# Altium schematic sheet XMC4504.SchDoc: <Project Name>
size A3; ApprovedBy: <Appr.>; Author: <Author>; CompanyName: Infineon Technologies AG; Engineer: <Rel.>; Organization: Infineon Technologies AG; Address1: IFAG DES S PS; Address2: Am Campeon 1-12  -  85579 Neubiberg  -  Germany; Address3: 85579 Neubiberg; Address4: Germany; Revision: <Rev.>; SheetNumber: 3; SheetTotal: 3; Release: RC00; PageSetup: Record=PageOptions|CenterHorizontal=True|CenterVertical=True|PrintScale=1.01|XCorrection=1.00|YCorrection=1.00|PrintKind=0|BorderSize=5000000|LeftOffset=0|BottomOffset=0|Orientation=2|PaperLength=1000|PaperWidth=1000|Scale=100|PaperSource=7|PrintQuality=-4|MediaType=1|DitherType=10|PaperKind=A3|PrintScaleMode=1; Doc_ConfidentialStatus: <Doc_ConfidentialStatus>; Doc_Preliminary: <Doc_Preliminary>
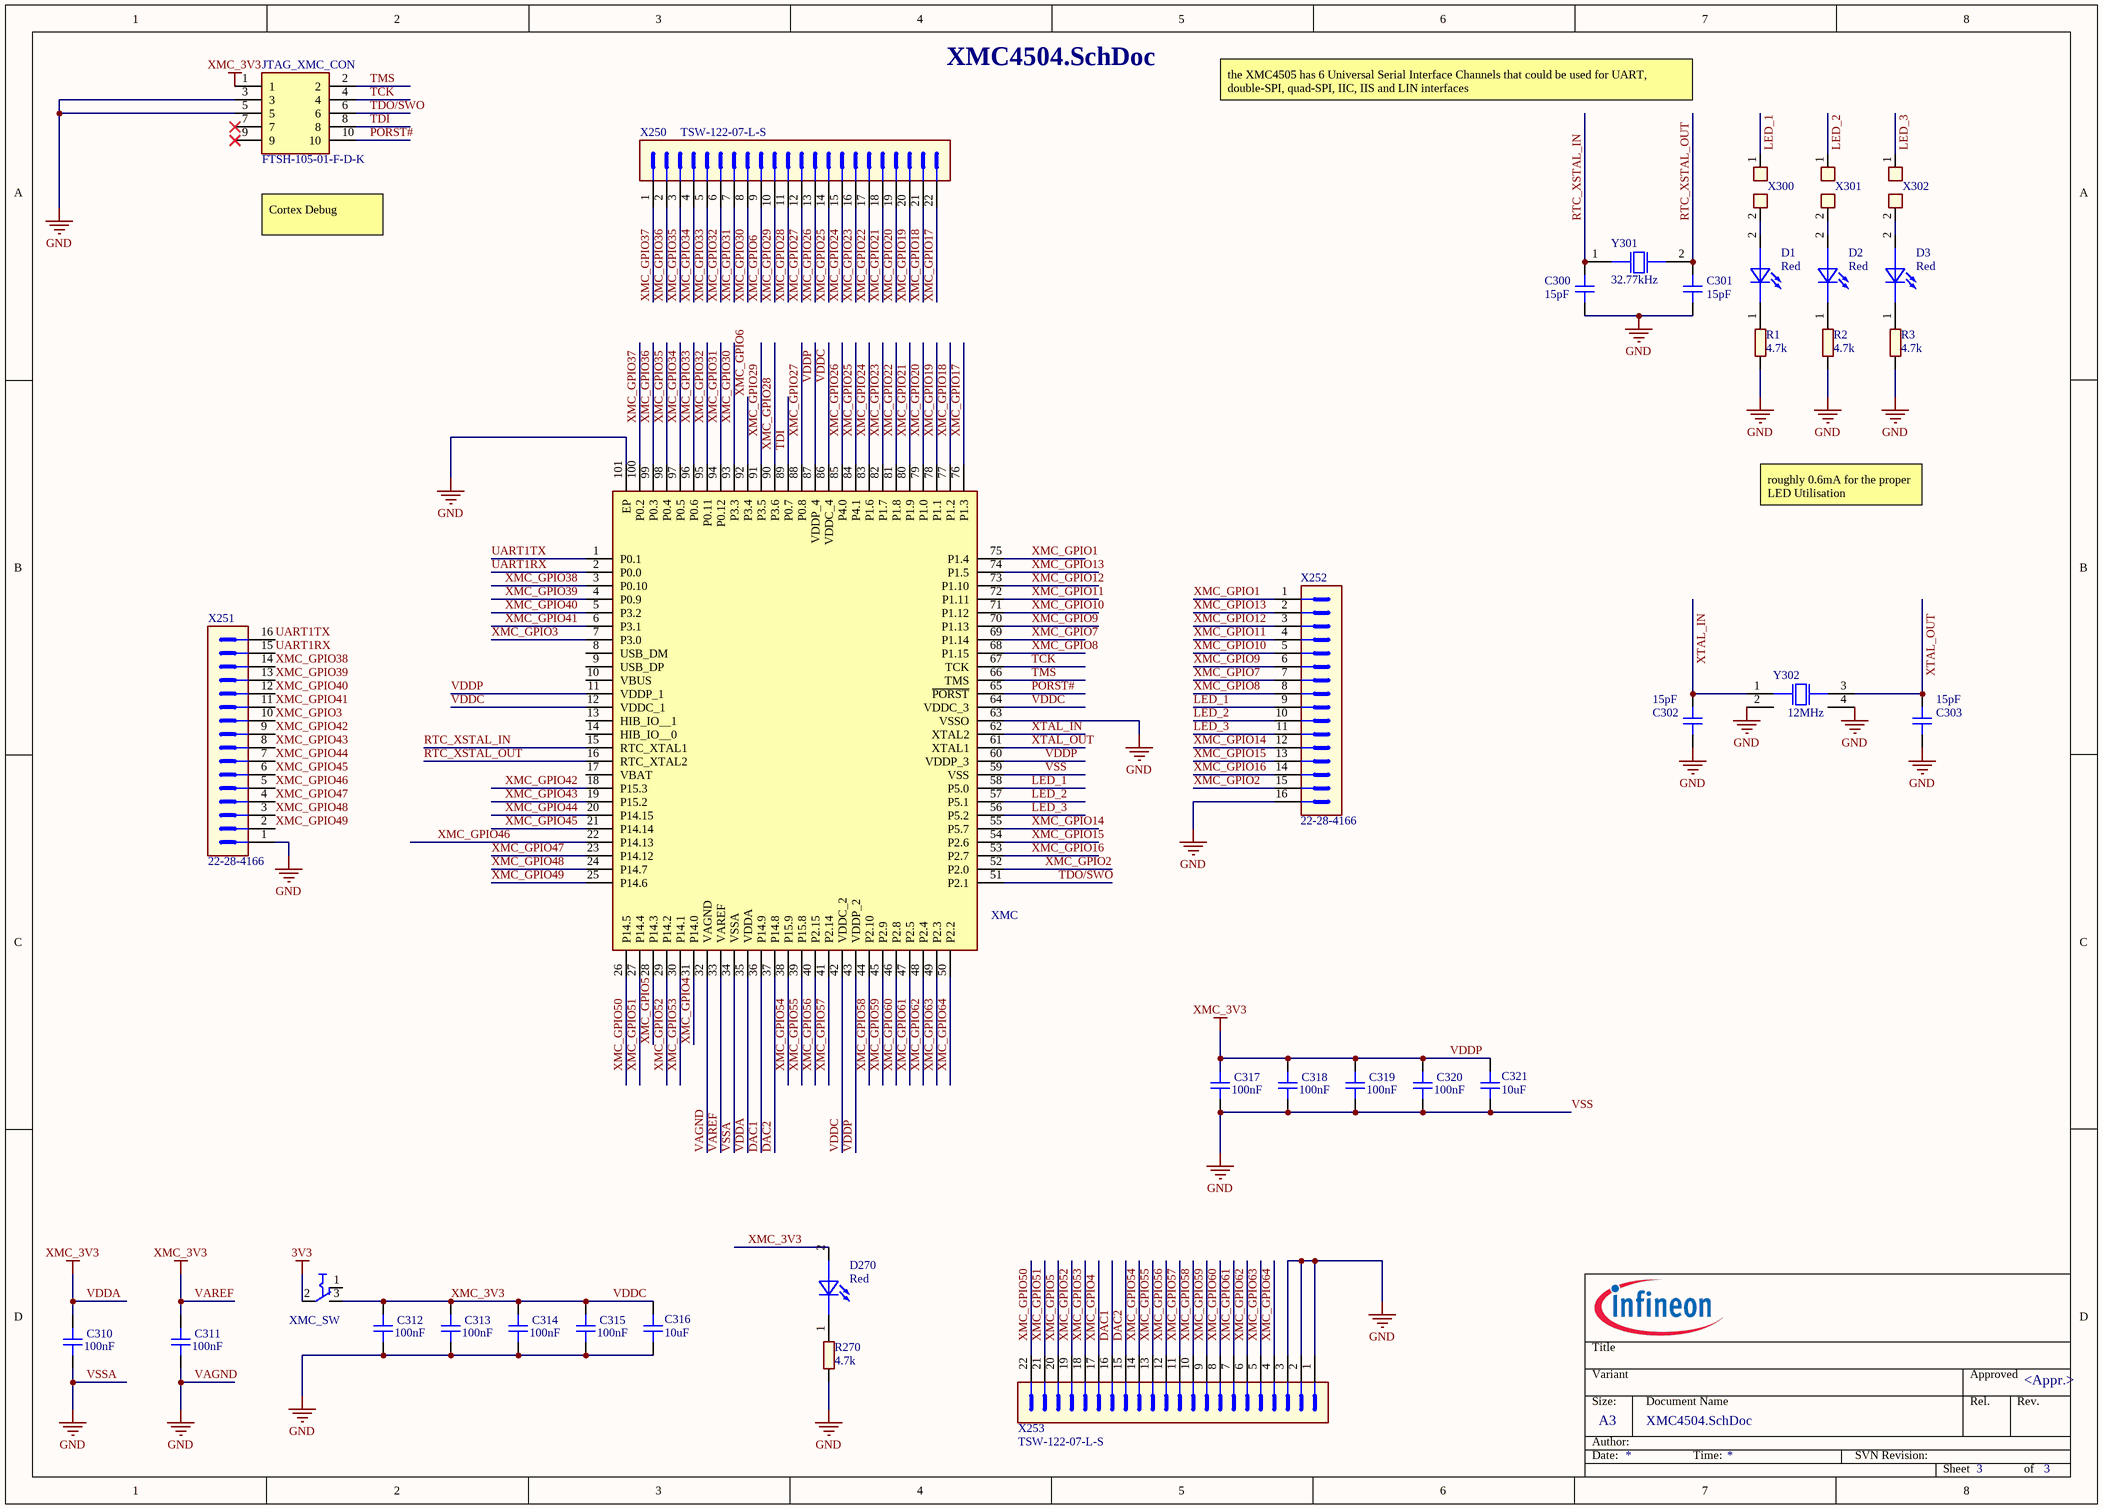
[diagram p0: XMC4504.SchDoc]

## Parts
C300  15pF  [CAPC1608X90N]
C301  15pF  [CAPC1608X90N]
C302  15pF  [CAPC1608X90N]
C303  15pF  [CAPC1608X90N]
C310  100nF  [CAPC1608X90N-2]
C311  100nF  [CAPC1608X90N-2]
C312  100nF  [CAPC1608X90N-2]
C313  100nF  [CAPC1608X90N-2]
C314  100nF  [CAPC1608X90N-2]
C315  100nF  [CAPC1608X90N-2]
C316  10uF  [CAPC3216X190N-1]
C317  100nF  [CAPC1608X90N-2]
C318  100nF  [CAPC1608X90N-2]
C319  100nF  [CAPC1608X90N-2]
C320  100nF  [CAPC1608X90N-2]
C321  10uF  [CAPC3216X190N-1]
D1  Red  [LEDSC160X80X80-2N-1]
D2  Red  [LEDSC160X80X80-2N-1]
D3  Red  [LEDSC160X80X80-2N-1]
D270  Red  [LEDSC160X80X80-2N-1]
JTAG_XMC_CON  FTSH-105-01-F-D-K  [FTSH-105-XX-YYY-D-K]
R1  4.7k  [RESC1609X55N]
R2  4.7k  [RESC1609X55N]
R3  4.7k  [RESC1609X55N]
R270  4.7k  [RESC1609X55N]
X250  TSW-122-07-L-S  [CON-M-THT-TSW-122-07-L-S]
X251  22-28-4166  [HDRV16W66P254_1X16_4064X249X838B]
X252  22-28-4166  [HDRV16W66P254_1X16_4064X249X838B]
X253  TSW-122-07-L-S  [CON-M-THT-TSW-122-07-L-S]
X300  Solder Jumper 2 Pins  [SOLDER_BRIDGE_0.7X1.299PAD]  (value not drawn)
X301  Solder Jumper 2 Pins  [SOLDER_BRIDGE_0.7X1.299PAD]  (value not drawn)
X302  Solder Jumper 2 Pins  [SOLDER_BRIDGE_0.7X1.299PAD]  (value not drawn)
XMC  XMC4504F100F512ACXQMA1  [QFP50P1600X1600X160-101N]  (value not drawn)
XMC_SW  CL-SB-12A-01T  [SW-SMD-CL-SB-12A-01T]  (value not drawn)
Y301  32.77kHz  [XTAL-SMD-NX3215SA-32.768K-STD-MUS-2]
Y302  12MHz  [XTAL-SMD-NX3225SA]

## Nets
3V3: XMC_SW.2
VAGND: C300.1 C301.1 C302.1 C303.1 C310.2 C311.2 C312.2 C313.2 C314.2 C315.2 C316.1 C317.2 C318.2 C319.2 C320.2 C321.1 JTAG_XMC_CON.3 JTAG_XMC_CON.5 R1.1 R2.1 R3.1 R270.1 X251.1 X252.16 X253.1 X253.2 X253.3 XMC.32(VAGND) XMC.34(VSSA) XMC.59(VSS) XMC.63(VSSO) XMC.101(EP) Y302.2 Y302.4  [also labelled GND, VSS, VSSA]
VAREF: C310.1 C311.1 C312.1 C313.1 C314.1 C315.1 C316.2 C317.1 C318.1 C319.1 C320.1 C321.2 D270.2(Anode) JTAG_XMC_CON.1 XMC.11(VDDP_1) XMC.12(VDDC_1) XMC.33(VAREF) XMC.35(VDDA) XMC.42(VDDC_2) XMC.43(VDDP_2) XMC.60(VDDP_3) XMC.64(VDDC_3) XMC.86(VDDC_4) XMC.87(VDDP_4) XMC_SW.3  [also labelled VDDA, VDDC, VDDP, XMC_3V3]
DAC1: X253.16 XMC.36(P14.9)
DAC2: X253.15 XMC.37(P14.8)
LED_1: X252.9 X300.1 XMC.58(P5.0)
LED_2: X252.10 X301.1 XMC.57(P5.1)
LED_3: X252.11 X302.1 XMC.56(P5.2)
PORST#: JTAG_XMC_CON.10 XMC.65(~{PORST})
RTC_XSTAL_IN: C300.2 XMC.15(RTC_XTAL1) Y301.1
RTC_XSTAL_OUT: C301.2 XMC.16(RTC_XTAL2) Y301.2
TCK: JTAG_XMC_CON.4 XMC.67(TCK)
TDI: JTAG_XMC_CON.8 XMC.89(P0.7)
TDO/SWO: JTAG_XMC_CON.6 XMC.51(P2.1)
TMS: JTAG_XMC_CON.2 XMC.66(TMS)
UART1RX: X251.15 XMC.2(P0.0)
UART1TX: X251.16 XMC.1(P0.1)
XMC_GPIO1: X252.1 XMC.75(P1.4)
XMC_GPIO2: X252.15 XMC.52(P2.0)
XMC_GPIO3: X251.10 XMC.7(P3.0)
XMC_GPIO4: X253.17 XMC.31(P14.0)
XMC_GPIO5: X253.20 XMC.28(P14.3)
XMC_GPIO6: X250.9 XMC.92(P3.4)
XMC_GPIO7: X252.7 XMC.69(P1.14)
XMC_GPIO8: X252.8 XMC.68(P1.15)
XMC_GPIO9: X252.6 XMC.70(P1.13)
XMC_GPIO10: X252.5 XMC.71(P1.12)
XMC_GPIO11: X252.4 XMC.72(P1.11)
XMC_GPIO12: X252.3 XMC.73(P1.10)
XMC_GPIO13: X252.2 XMC.74(P1.5)
XMC_GPIO14: X252.12 XMC.55(P5.7)
XMC_GPIO15: X252.13 XMC.54(P2.6)
XMC_GPIO16: X252.14 XMC.53(P2.7)
XMC_GPIO17: X250.22 XMC.76(P1.3)
XMC_GPIO18: X250.21 XMC.77(P1.2)
XMC_GPIO19: X250.20 XMC.78(P1.1)
XMC_GPIO20: X250.19 XMC.79(P1.0)
XMC_GPIO21: X250.18 XMC.80(P1.9)
XMC_GPIO22: X250.17 XMC.81(P1.8)
XMC_GPIO23: X250.16 XMC.82(P1.7)
XMC_GPIO24: X250.15 XMC.83(P1.6)
XMC_GPIO25: X250.14 XMC.84(P4.1)
XMC_GPIO26: X250.13 XMC.85(P4.0)
XMC_GPIO27: X250.12 XMC.88(P0.8)
XMC_GPIO28: X250.11 XMC.90(P3.6)
XMC_GPIO29: X250.10 XMC.91(P3.5)
XMC_GPIO30: X250.8 XMC.93(P3.3)
XMC_GPIO31: X250.7 XMC.94(P0.12)
XMC_GPIO32: X250.6 XMC.95(P0.11)
XMC_GPIO33: X250.5 XMC.96(P0.6)
XMC_GPIO34: X250.4 XMC.97(P0.5)
XMC_GPIO35: X250.3 XMC.98(P0.4)
XMC_GPIO36: X250.2 XMC.99(P0.3)
XMC_GPIO37: X250.1 XMC.100(P0.2)
XMC_GPIO38: X251.14 XMC.3(P0.10)
XMC_GPIO39: X251.13 XMC.4(P0.9)
XMC_GPIO40: X251.12 XMC.5(P3.2)
XMC_GPIO41: X251.11 XMC.6(P3.1)
XMC_GPIO42: X251.9 XMC.18(P15.3)
XMC_GPIO43: X251.8 XMC.19(P15.2)
XMC_GPIO44: X251.7 XMC.20(P14.15)
XMC_GPIO45: X251.6 XMC.21(P14.14)
XMC_GPIO46: X251.5 XMC.22(P14.13)
XMC_GPIO47: X251.4 XMC.23(P14.12)
XMC_GPIO48: X251.3 XMC.24(P14.7)
XMC_GPIO49: X251.2 XMC.25(P14.6)
XMC_GPIO50: X253.22 XMC.26(P14.5)
XMC_GPIO51: X253.21 XMC.27(P14.4)
XMC_GPIO52: X253.19 XMC.29(P14.2)
XMC_GPIO53: X253.18 XMC.30(P14.1)
XMC_GPIO54: X253.14 XMC.38(P15.9)
XMC_GPIO55: X253.13 XMC.39(P15.8)
XMC_GPIO56: X253.12 XMC.40(P2.15)
XMC_GPIO57: X253.11 XMC.41(P2.14)
XMC_GPIO58: X253.10 XMC.44(P2.10)
XMC_GPIO59: X253.9 XMC.45(P2.9)
XMC_GPIO60: X253.8 XMC.46(P2.8)
XMC_GPIO61: X253.7 XMC.47(P2.5)
XMC_GPIO62: X253.6 XMC.48(P2.4)
XMC_GPIO63: X253.5 XMC.49(P2.3)
XMC_GPIO64: X253.4 XMC.50(P2.2)
XTAL_IN: C302.2 XMC.62(XTAL2) Y302.1
XTAL_OUT: C303.2 XMC.61(XTAL1) Y302.3
NetD1_1: D1.1(Cathode) R1.2
NetD1_2: D1.2(Anode) X300.2
NetD2_1: D2.1(Cathode) R2.2
NetD2_2: D2.2(Anode) X301.2
NetD3_1: D3.1(Cathode) R3.2
NetD3_2: D3.2(Anode) X302.2
NetD270_1: D270.1(Cathode) R270.2

Not connected (* = marked no-connect by the designer): JTAG_XMC_CON 7* 9*; XMC 8(USB_DM) 9(USB_DP) 10(VBUS) 13(HIB_IO__1) 14(HIB_IO__0) 17(VBAT); XMC_SW 1

## Notes on the sheet
- the XMC4505 has 6 Universal Serial Interface Channels that could be used for UART, double-SPI, quad-SPI, IIC, IIS and LIN interfaces
- Cortex Debug
- roughly 0.6mA for the proper LED Utilisation
- Title
- Variant
- Approved
- Date:
- Author:
- Size:
- A3
- Document Name
- Time:
- SVN Revision:
- Rel.
- Rev.
- Sheet
- of

## Library data of the parts
C300-C303 = 267405: CAP / CERA / 15pF / 50V / 2% / C0G (EIA) / NP0 / -55°C to 125°C / 0603(1608) / SMD / -; Multiple Parts: No; Legacy PartNumber: CAP01002488; Manufacturer: MuRata; Manufacturer Order Number: GRM1885C1H150GA01; Symbol Type: Capacitor; Single; Standard; 2 Pins; Alternate View: Yes; Article Number: 267405; Version Number: V01; Combined Parameters: TC:C0G (EIA) / NP0;Tol.:-2%/+2%;Vdc:50V; QuickPick: 15pF / 50V / 2% / C0G (EIA) / NP0 / 0603 (1608); Type: Standard; Style: Single; Package Metric: 1608; Package Imperial: 0603; ComponentStatus: Released; PLMStatus: Not Recommended For New Designs; Legacy DeviceID: CAP01002488; Part Type: Capacitor; Value: 15pF; Tolerance Neg: 2%; Tolerance Pos: 2%; Application: Standard; Technology: Ceramic; Temperature min: -55; Temperature max: 125; Temperature Range: Military; ROHS Compliant: Y; Automotive Qualified: No; PackageReference: 0603 (1608); ComponentLink1Description: Vendor WebSite; ComponentLink1URL: http://www.murata.com/; ComponentLink2Description: Datasheet; ComponentLink2URL: http://webnetprod.muc.infineon.com/PCBPortal_Prod/WorkFlows/AltiumComponent/StandardDocumentation?Versionid=267406; Supplier 1: Farnell; Supplier 2: DigiKey; Supplier 3: Mouser; Second Source allowed: Yes; Voltage DC (max): 50V; Package Description: Capacitor,non-polarized,Chip;1.60mm L X 0.80mm W X 0.90mm H
C310-C315 C317-C320 = 479045: CAP / CERA / 100nF / 50V / 10% / X7R (EIA) / -55°C to 125°C / 0603 / SMD / -; Multiple Parts: No; Manufacturer: AVX; Manufacturer Order Number: 06035C104KAT2A; Symbol Type: Capacitor; Single; Standard; 2 Pins; Alternate View: Yes; Article Number: 479045; Version Number: V01; Combined Parameters: TC:X7R (EIA);Tol.:-10%/+10%;Vdc:50V; QuickPick: 100nF / 50V / 10% / X7R (EIA) / 0603; Type: Standard; Style: Single; ComponentStatus: Released; PLMStatus: Active; Part Type: Capacitor; Value: 100nF; Tolerance Neg: 10%; Tolerance Pos: 10%; Application: Standard; Technology: Ceramic; Temperature min: -55; Temperature max: 125; Temperature Range: Military; ROHS Compliant: Y; Automotive Qualified: No; PackageReference: 0603; ComponentLink1Description: Vendor WebSite; ComponentLink1URL: http://www.avx.com; ComponentLink2Description: Datasheet; ComponentLink2URL: http://webnetprod.muc.infineon.com/PCBPortal_Prod/WorkFlows/AltiumComponent/StandardDocumentation?Versionid=479046; Supplier 1: Farnell; Supplier Part Number 1: 2280883; Supplier 2: DigiKey; Supplier Part Number 2: 478-5052-2-ND; Supplier 3: Mouser; Supplier Part Number 3: 581-06035C104KAT2A; Second Source allowed: Yes; Voltage DC (max): 50V; Package Description: Capacitor,non-polarized,Chip;1.60mm L X 0.81mm W X 0.90mm H
C316 C321 = 648992: CAP / CERA / 10uF / 50V / 20% / X5R (EIA) / -55°C to 85°C / 1206 (3216) / SMD / -; Multiple Parts: No; Manufacturer: Taiyo Yuden; Manufacturer Order Number: UMK316BBJ106ML-T; Symbol Type: Capacitor; Single; Standard; 2 Pins; Alternate View: Yes; Article Number: 648992; Version Number: V00; Combined Parameters: TC:X5R (EIA);Tol.:-20%/+20%;Vdc:50V; QuickPick: 10uF / 50V / 20% / X5R (EIA) / 1206 (3216); Type: Standard; Style: Single; ComponentStatus: Released; PLMStatus: Active; Part Type: Capacitor; Value: 10uF; Tolerance Neg: 20%; Tolerance Pos: 20%; Application: Standard; Technology: Ceramic; Temperature min: -55; Temperature max: 85; Temperature Range: Military; ROHS Compliant: Y; Automotive Qualified: No; PackageReference: 1206 (3216); ComponentLink1Description: Vendor WebSite; ComponentLink1URL: http://www.yuden.co.jp/or/product/; ComponentLink2Description: Datasheet; ComponentLink2URL: http://webnetprod.muc.infineon.com/PCBPortal_Prod/WorkFlows/AltiumComponent/StandardDocumentation?Versionid=648993; Supplier 1: Farnell; Supplier Part Number 1: 2779059; Supplier 2: DigiKey; Supplier Part Number 2: 587-3248-1-ND; Supplier 3: Mouser; Supplier Part Number 3: 963-UMK316BBJ106ML-T; Second Source allowed: Yes; Voltage DC (max): 50V; Package Description: Capacitor,non-polarized,Chip;3.20mm L X 1.60mm W X 1.90mm H
D1-D3 D270 = 625459: WL-SMCW SMT Mono-color Chip LED Waterclear, Red,630nm; Manufacturer: Wurth Elektronik; Manufacturer Order Number: 150060RS75000; Symbol Type: Standard LED Symbol, 1 Cathode, 2 Anode; Article Number: 625459; Version Number: V01; Combined Parameters: Vf:2.4V;If:30mA;Ur:5V;Ir:10uA;Pmax:72mW; QuickPick: LED / 1608 (0603); Style: Single; Automotive Qualified: No; ComponentStatus: Released; PLMStatus: Active; Second Source allowed: Yes; Voltage DC (max): na; Part Type: Diode; Value: Red; Type: LED; Application: Standard; Temperature min: -40; Temperature max: 85; Temperature Range: Industrial; ROHS Compliant: Y; PackageReference: 1608 (0603); ComponentLink1Description: Vendor WebSite; ComponentLink1URL: http://www.we-online.com; ComponentLink2Description: Datasheet; ComponentLink2URL: http://webnetprod.muc.infineon.com/PCBPortal_Prod/WorkFlows/AltiumComponent/StandardDocumentation?Versionid=625460; Supplier 1: Farnell; Supplier Part Number 1: 2322071; Supplier 2: DigiKey; Supplier Part Number 2: 732-4978-1-ND; Supplier 3: Mouser; Supplier Part Number 3: 710-150060RS75000; Package Description: LED,Side Concave; 2 pin,1.60mm W X 0.80mm L X 0.80mm H
JTAG_XMC_CON = FTSH-105-01-F-D-K: Connector; Manufacturer_Name: SAMTEC; Datasheet Link: https://componentsearchengine.com//FTSH-105-01-F-D-K.pdf; Mouser2 Part Number: 200-FTSH10501FDK; Mouser2 Price/Stock: https://www.mouser.com/Search/Refine.aspx?Keyword=200-FTSH10501FDK; Manufacturer_Part_Number: FTSH-105-01-F-D-K
R1-R3 R270 = 699381: RES / STD / 4.7k / 100mW / 1% / 100ppm/K / -55°C to 155°C / 1.60mm L X 0.85mm W X 0.55mm H / - / -; Multiple Parts: No; Manufacturer: Panasonic; Manufacturer Order Number: ERJ3EKF4701V; Symbol Type: Resistor; Single; Standard; 2 Pins; Alternate View: Yes; Article Number: 699381; Version Number: V00; Combined Parameters: TCR:100ppm/K;Tol.:-1%/+1%;Vdc:-;Idc:-;P:100mW; QuickPick: 4.7k / 1% / 0.1 / ERJ3EKF4701V; Style: Single; Automotive Qualified: AEC Q200; ComponentStatus: Released; PLMStatus: Active; Part Type: Resistor; Value: 4.7k; Tolerance Neg: 1%; Tolerance Pos: 1%; Type: Standard; Application: Standard; Technology: Thick Film; Temperature min: -55; Temperature max: 155; Temperature Range: Military; ROHS Compliant: Y; PackageReference: ERJ3EKF4701V; ComponentLink1Description: Vendor WebSite; ComponentLink1URL: http://panasonic.net/sanyo/index.html; ComponentLink2Description: Datasheet; ComponentLink2URL: http://webnetprod.muc.infineon.com/PCBPortal_Prod/WorkFlows/AltiumComponent/StandardDocumentation?Versionid=699382; Supplier 1: Farnell; Supplier Part Number 1: 2303181; Supplier 2: DigiKey; Supplier Part Number 2: P4.70KHCT-ND; Supplier 3: Mouser; Supplier Part Number 3: 667-ERJ-3EKF4701V; Second Source allowed: Yes; Package Description: Resistor,Chip;1.60mm L X 0.85mm W X 0.55mm H
X250 X253 = 385945: Through hole .025 SQ Post Header, 2.54mm pitch, 22 pin, vertical, single row; Legacy PartNumber: CON01500868; Manufacturer: Samtec; Symbol type: Header 22pins; Article Number: 385945; Version Number: V01; Legacy DeviceID: SAM_TSW-122-07-L-S; Combined Parameters: Board-to-Board/Cable Header (male);22x1;Mounting:THT;Orient:0° (vertical);Shielded:No; QuickPick: 0° (vertical) / Board-to-Board/Cable; Style: Strip; Automotive Qualified: No; ComponentStatus: Released; PLMStatus: Active; Second Source allowed: Yes; Voltage DC (max): na; Part Type: Connector; Manufacturer Order Number: TSW-122-07-L-S; Value: TSW-122-07-L-S; Type: Board-to-Board/Cable; Temperature min: -55; Temperature max: 125; Temperature Range: Military; ROHS Compliant: Y; ComponentLink1Description: Vendor WebSite; ComponentLink1URL: http://www.samtec.com/; ComponentLink2Description: Datasheet; ComponentLink2URL: http://webnetprod.muc.infineon.com/PCBPortal_Prod/WorkFlows/AltiumComponent/StandardDocumentation?Versionid=385946; Supplier 1: Farnell; Supplier Part Number 1: 2035626; Supplier 2: DigiKey; Supplier Part Number 2: SAM1031-22-ND; Supplier 3: Mouser; Package Description: Header, Vertical, 2.54mm pitch; 0.64mm lead width, 22 pins, Single row, 55.88mm L X 2.54mm W X 8.712mm H body
X251 X252 = 377324: 2.54mm Pitch KK header, Breakaway, Vertical, 16 Circuits, 0.76um Gold Selective Plating, Mating Pin Length 6.09mm; Legacy PartNumber: CON01500040; Manufacturer: Molex; Symbol Type: Header 16 pins; Alternate View: No; Article Number: 377324; Version Number: V01; Legacy DeviceID: MOL_22-28-4166; Combined Parameters: Board-to-Board Header (male);16x1;Mounting:THT;Orient:0° (vertical);Shielded:No; QuickPick: 0° (vertical) / Board-to-Board; Style: Strip; ComponentStatus: Released; PLMStatus: Active; Second Source allowed: Yes; Voltage DC (max): na; Multiple Parts: No; Part Type: Connector; Manufacturer Order Number: 22-28-4166; Value: 22-28-4166; Type: Board-to-Board; Temperature min: -40; Temperature max: 105; Temperature Range: Industrial; ROHS Compliant: Y; Automotive Qualified: No; ComponentLink1Description: Vendor WebSite; ComponentLink1URL: http://www.molex.com; ComponentLink2Description: Datasheet; ComponentLink2URL: http://webnetprod.muc.infineon.com/PCBPortal_Prod/WorkFlows/AltiumComponent/StandardDocumentation?Versionid=377325; Supplier 1: Farnell; Supplier 2: DigiKey; Supplier Part Number 2: 22-28-4166-ND; Supplier 3: Mouser; Supplier Part Number 3: 538-22-28-4166; Package Description: 2.54mm Pitch KK header, Breakaway, Vertical, 16 Circuits, 0.76um Gold Selective Plating, Mating Pin Length 6.09mm
X300-X302 = 433601: Multiple Parts: No; Legacy PartNumber: CON01500959; Manufacturer: Infineon Technologies; Alternate View: Yes; Article Number: 433601; Version Number: V01; Legacy DeviceID: IFX_Solder Jumper 2 Pins; Combined Parameters: - None (onboard);2x1;Mounting:SMT;Orient:None (onboard);Shielded:No; QuickPick: None (onboard); Style: Not Applicable; ComponentStatus: Released; PLMStatus: Active; Voltage DC (max): na; Symbol Type: Solder Jumper 2 Pins; Part Type: Connector; Manufacturer Order Number: Solder Jumper 2 Pins; Value: Solder Jumper 2 Pins; Temperature min: 0; Temperature max: 0; Temperature Range: Military; ROHS Compliant: N; Automotive Qualified: No; ComponentLink1Description: Vendor WebSite; ComponentLink1URL: https://www.infineon.com/; ComponentLink2Description: Datasheet; Supplier 1: Farnell; Supplier 2: DigiKey; Supplier 3: Mouser; Second Source allowed: Yes; Package Description: Solder Bridge 2 Pins, 0.7X1.299mm Pad, 1.6mm L X 1.2mm W body
XMC = XMC4504F100F512ACXQMA1: Integrated Circuit; Manufacturer_Name: Infineon; Height: 1.6mm; Manufacturer_Part_Number: XMC4504F100F512ACXQMA1
XMC_SW = 650099: Slid Switch, 12V, 200mA; Manufacturer: NIDEC COPAL ELECTRONICS, Inc.; Symbol Type: Switch, 2 Change Over 1 3, 3 Pins; Article Number: 650099; Version Number: V00; Automotive Qualified: No; ComponentStatus: Released; PLMStatus: Active; Second Source allowed: Yes; Voltage DC (max): na; Part Type: Electro Mechanic; Manufacturer Order Number: CL-SB-12A-01T; Value: CL-SB-12A-01T; Application: Power; Temperature min: -40; Temperature max: 85; Temperature Range: Industrial; ROHS Compliant: Y; ComponentLink1Description: Vendor WebSite; ComponentLink1URL: www.copal-electronics.com/; ComponentLink2Description: Datasheet; ComponentLink2URL: http://webnetprod.muc.infineon.com/PCBPortal_Prod/WorkFlows/AltiumComponent/StandardDocumentation?Versionid=650100; Supplier 1: Farnell; Supplier Part Number 1: 2854744; Supplier 2: DigiKey; Supplier Part Number 2: 563-1314-1-ND; Supplier 3: Mouser; Supplier Part Number 3: 229-CL-SB-12A-01T; Package Description: Switch, SMD, 3 Pins, 3.50 mm W X 8.50 mm L X 6.10 mm H body
Y301 = 641898: CRYSTAL 32.7680KHZ 12.5PF SMD; Manufacturer: CTS Electronic Component; Manufacturer Order Number: TFA322PH327KR; Symbol type: Standard Crystal Symbol, 2 Pins; Article Number: 641898; Version Number: V01; Tolerance Neg: 20%; Combined Parameters: Standard Standard Crystal;Tol.:-20%/+20%; QuickPick: 32770 / Crystal; Style: Standard; Automotive Qualified: AEC Q200; ComponentStatus: Released; PLMStatus: Active; Second Source allowed: Yes; Voltage DC (max): na; Part Type: Clock; Value: 32.77kHz; Tolerance Pos: 20%; Type: Crystal; Application: Standard; Temperature min: -40; Temperature max: 125; Temperature Range: Automotive; ROHS Compliant: Y; PackageReference: SMD 3.2 x 1.5 x 0.9 mm; ComponentLink1Description: Vendor WebSite; ComponentLink1URL: http://www.ctscorp.com/; ComponentLink2Description: Datasheet; ComponentLink2URL: http://webnetprod.muc.infineon.com/PCBPortal_Prod/WorkFlows/AltiumComponent/StandardDocumentation?Versionid=641899; Supplier 1: Farnell; Supplier 2: DigiKey; Supplier Part Number 2: CTX1454CT-ND; Supplier 3: Mouser; Supplier Part Number 3: 774-TFA322PH327KR; Package Description: Crystal; 3.2mm W X 1.5mm L X 0.9mm H body
Y302 = 409657: SMD Crystal Unit for Automotive Application, 12.000MHz; Legacy PartNumber: IC02600619; Manufacturer: Nihon Dempa Kogyo; Manufacturer Order Number: NX3225SA-12.000M-STD-CRS-2; Symbol type: Standard Crystal Symbol, 4 Pins; Article Number: 409657; Version Number: V01; Legacy DeviceID: NDK_NX3225SA-12.000M-STD-CRS-2; Tolerance Neg: 50%; Combined Parameters: Standard Standard Crystal;Tol.:-50%/+50%; QuickPick: 12000000 / Crystal; Style: Standard; Automotive Qualified: AEC Q200; ComponentStatus: Released; PLMStatus: Active; Second Source allowed: Yes; Voltage DC (max): na; Part Type: Clock; Value: 12MHz; Tolerance Pos: 50%; Type: Crystal; Application: Standard; Temperature min: -40; Temperature max: 125; Temperature Range: Automotive; ROHS Compliant: Y; PackageReference: SMD 3.2 x 2.5 x 0.6mm; ComponentLink1Description: Vendor WebSite; ComponentLink1URL: http://www.ndk.com/en/; ComponentLink2Description: Datasheet; ComponentLink2URL: http://webnetprod.muc.infineon.com/PCBPortal_Prod/WorkFlows/AltiumComponent/StandardDocumentation?Versionid=409658; Supplier 1: Farnell; Supplier 2: DigiKey; Supplier Part Number 2: 644-1128-2-ND; Supplier 3: Mouser; Package Description: Crystal; 3.2mm W X 2.5mm L X 0.6mm H body